# EAGLE design beagletone_studio (EAGLE 6.4)

## Sheet 1 of 3
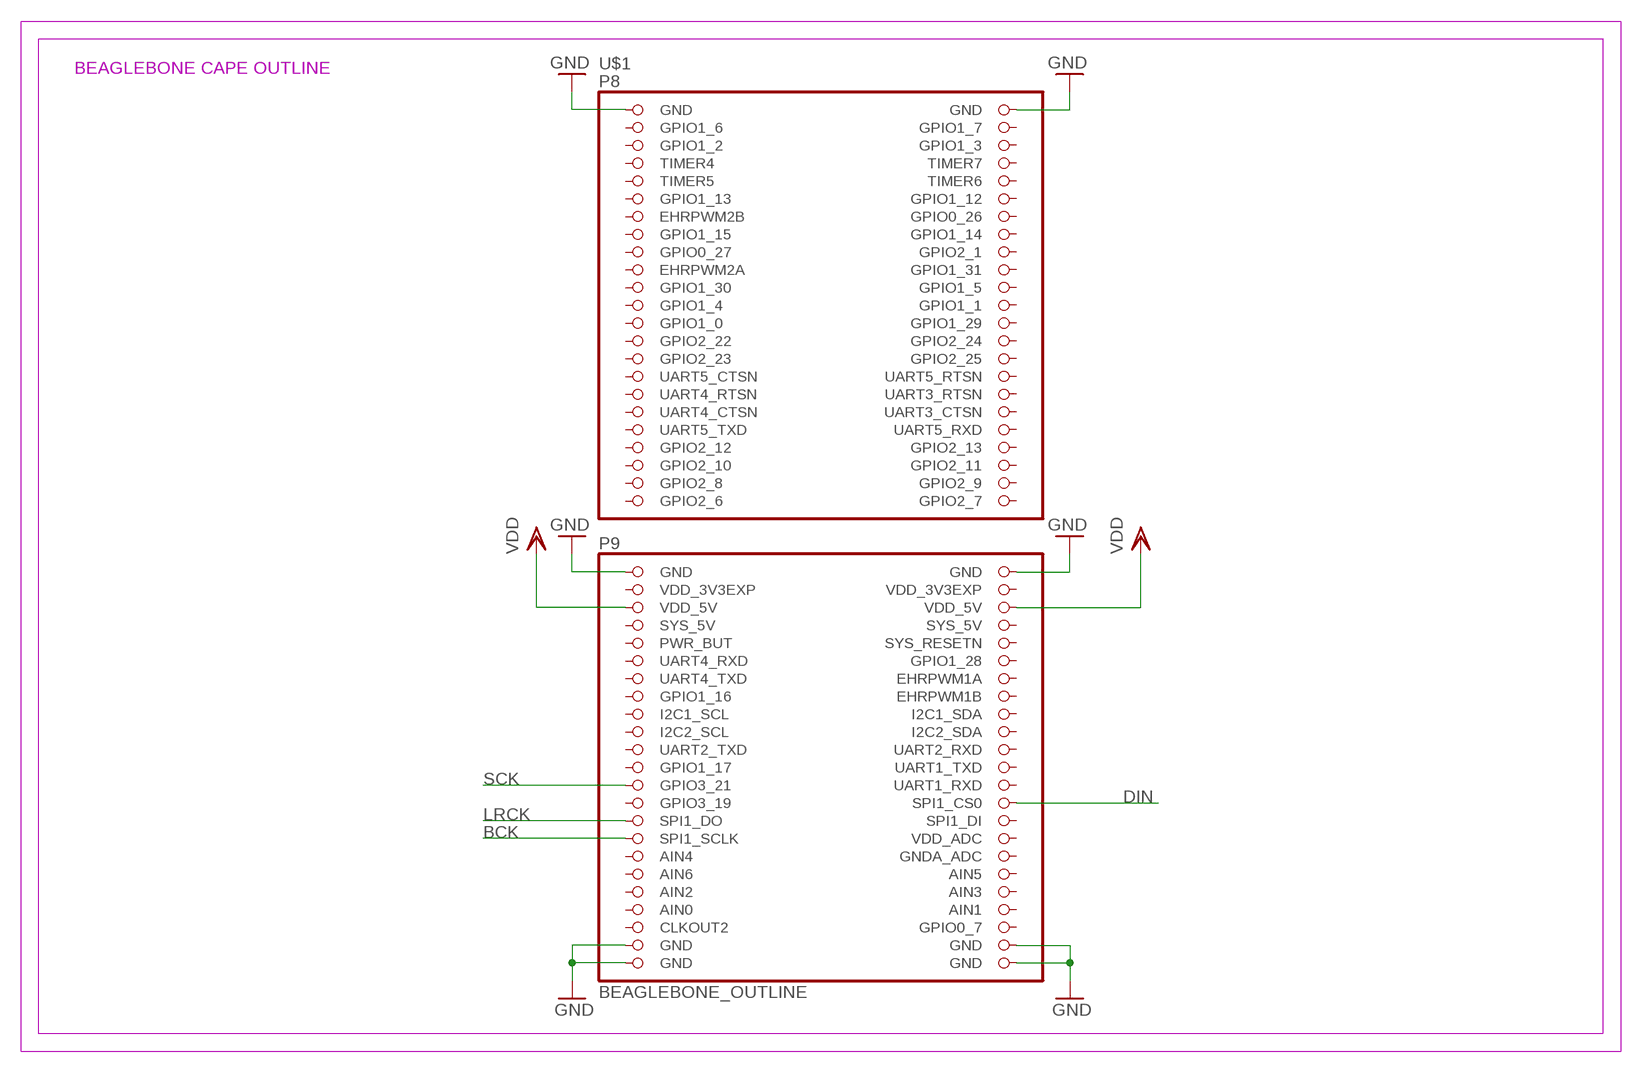
[diagram p0: schematic, sheet 1]

### Parts
U$1  BEAGLEBONE_OUTLINE  [BEAGLEBONE_SHIELD]

### Nets
BCK: U$1.77(SPI1_SCLK) ; also sheet 2
DIN: U$1.74(SPI1_CS0) ; also sheet 2
GND: U$1.1(GND) U$1.2(GND) U$1.47(GND) U$1.48(GND) U$1.89(GND) U$1.90(GND) U$1.91(GND) U$1.92(GND) ; also sheet 2,3
LRCK: U$1.75(SPI1_DO) ; also sheet 2
SCK: U$1.71(GPIO3_21) ; also sheet 2
VDD: U$1.51(VDD_5V) U$1.52(VDD_5V) ; also sheet 2
Unconnected: U$1.3(GPIO1_6) U$1.4(GPIO1_7) U$1.5(GPIO1_2) U$1.6(GPIO1_3) U$1.7(TIMER4) U$1.8(TIMER7) U$1.9(TIMER5) U$1.10(TIMER6) U$1.11(GPIO1_13) U$1.12(GPIO1_12) U$1.13(EHRPWM2B) U$1.14(GPIO0_26) U$1.15(GPIO1_15) U$1.16(GPIO1_14) U$1.17(GPIO0_27) U$1.18(GPIO2_1) U$1.19(EHRPWM2A) U$1.20(GPIO1_31) U$1.21(GPIO1_30) U$1.22(GPIO1_5) U$1.23(GPIO1_4) U$1.24(GPIO1_1) U$1.25(GPIO1_0) U$1.26(GPIO1_29) U$1.27(GPIO2_22) U$1.28(GPIO2_24) U$1.29(GPIO2_23) U$1.30(GPIO2_25) U$1.31(UART5_CTSN) U$1.32(UART5_RTSN) U$1.33(UART4_RTSN) U$1.34(UART3_RTSN) U$1.35(UART4_CTSN) U$1.36(UART3_CTSN) U$1.37(UART5_TXD) U$1.38(UART5_RXD) U$1.39(GPIO2_12) U$1.40(GPIO2_13) U$1.41(GPIO2_10) U$1.42(GPIO2_11) U$1.43(GPIO2_8) U$1.44(GPIO2_9) U$1.45(GPIO2_6) U$1.46(GPIO2_7) U$1.54(SYS_5V) U$1.55(PWR_BUT) U$1.56(SYS_RESETN) U$1.57(UART4_RXD) U$1.58(GPIO1_28) U$1.59(UART4_TXD) U$1.60(EHRPWM1A) U$1.61(GPIO1_16) U$1.62(EHRPWM1B) U$1.63(I2C1_SCL) U$1.64(I2C1_SDA) U$1.65(I2C2_SCL) U$1.66(I2C2_SDA) U$1.67(UART2_TXD) U$1.68(UART2_RXD) U$1.69(GPIO1_17) U$1.70(UART1_TXD) U$1.72(UART1_RXD) U$1.73(GPIO3_19) U$1.76(SPI1_DI) U$1.78(VDD_ADC) U$1.79(AIN4) U$1.80(GNDA_ADC) U$1.81(AIN6) U$1.82(AIN5) U$1.83(AIN2) U$1.84(AIN3) U$1.86(AIN1) U$1.87(CLKOUT2) U$1.88(GPIO0_7)

### Notes on the sheet
- BEAGLEBONE CAPE OUTLINE

## Sheet 2 of 3
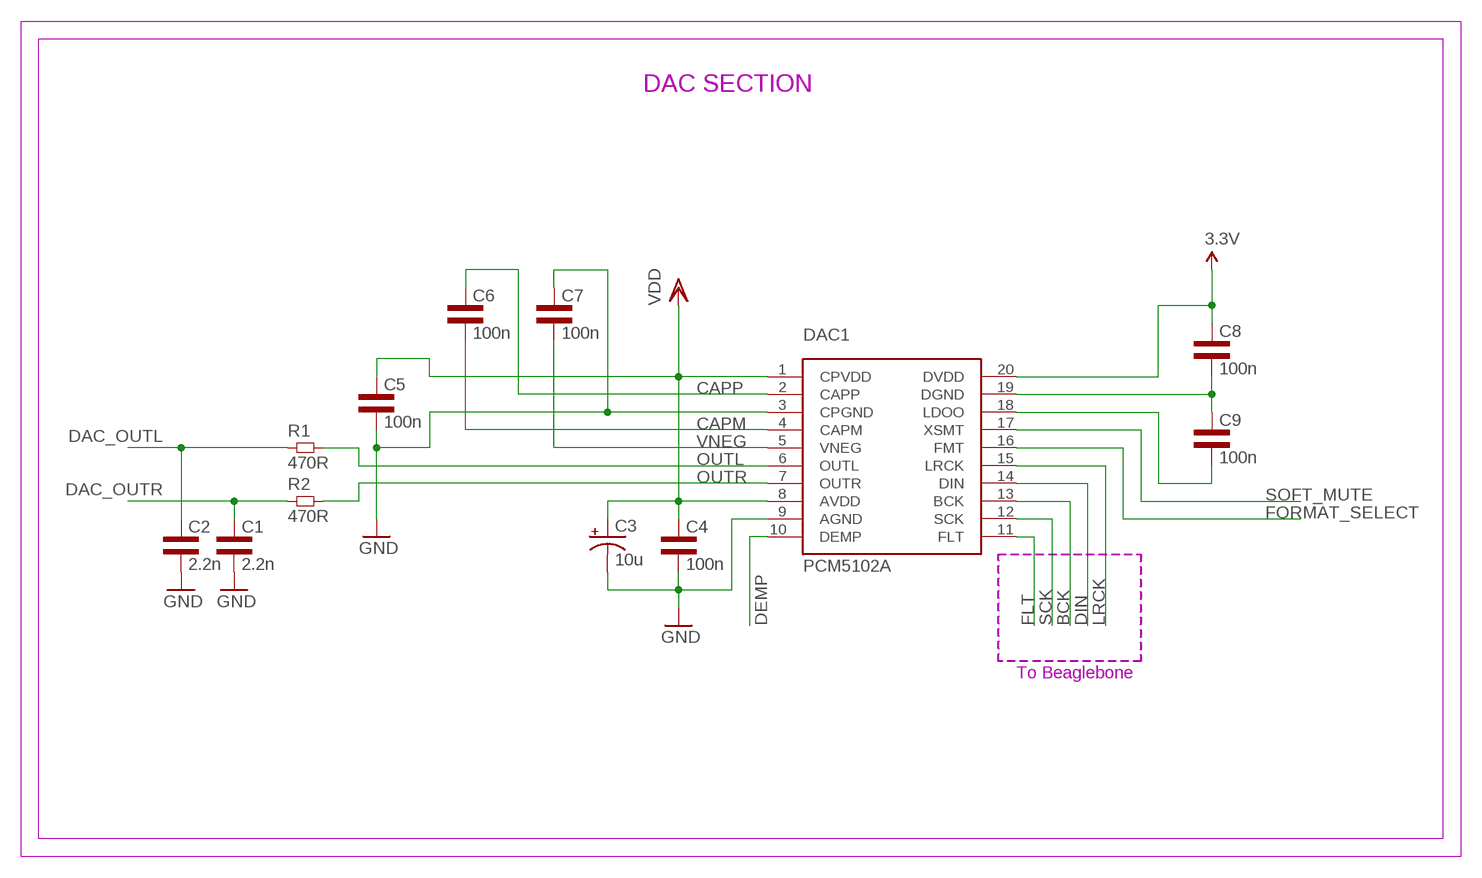
[diagram p1: schematic, sheet 2]

### Parts
C1  2.2n  CAP0603L3  [0603L3]
C2  2.2n  CAP0603L3  [0603L3]
C3  10u  CPOL-USCT3216  [CT3216]
C4  100n  CAP0603L3  [0603L3]
C5  100n  CAP0603L3  [0603L3]
C6  100n  CAP0603L3  [0603L3]
C7  100n  CAP0603L3  [0603L3]
C8  100n  CAP0402L3  [0402L3]
C9  100n  CAP0402L3  [0402L3]
DAC1  PCM5102A  [R-PDSO-G20_65]
R1  470R  RES0603L3  [0603L3]
R2  470R  RES0603L3  [0603L3]

### Nets
3.3V: C8.P$1 DAC1.20(DVDD)
BCK: DAC1.13(BCK) ; also sheet 1
CAPM: C6.P$2 DAC1.4(CAPM)
CAPP: C6.P$1 DAC1.2(CAPP)
DAC_OUTL: C2.P$1 R1.P$1 ; also sheet 3
DAC_OUTR: C1.P$1 R2.P$1 ; also sheet 3
DEMP: DAC1.10(DEMP)
DIN: DAC1.14(DIN) ; also sheet 1
FLT: DAC1.11(FLT)
FORMAT_SELECT: DAC1.16(FMT)
GND: C1.P$2 C2.P$2 C3.- C4.P$2 C5.P$2 C7.P$1 DAC1.3(CPGND) DAC1.9(AGND) ; also sheet 1,3
LRCK: DAC1.15(LRCK) ; also sheet 1
N$1: C8.P$2 C9.P$1 DAC1.19(DGND)
N$3: C9.P$2 DAC1.18(LDOO)
OUTL: DAC1.6(OUTL) R1.P$2
OUTR: DAC1.7(OUTR) R2.P$2
SCK: DAC1.12(SCK) ; also sheet 1
SOFT_MUTE: DAC1.17(XSMT)
VDD: C3.+ C4.P$1 C5.P$1 DAC1.1(CPVDD) DAC1.8(AVDD) ; also sheet 1
VNEG: C7.P$2 DAC1.5(VNEG)

### Notes on the sheet
- DAC SECTION
- To Beaglebone

## Sheet 3 of 3
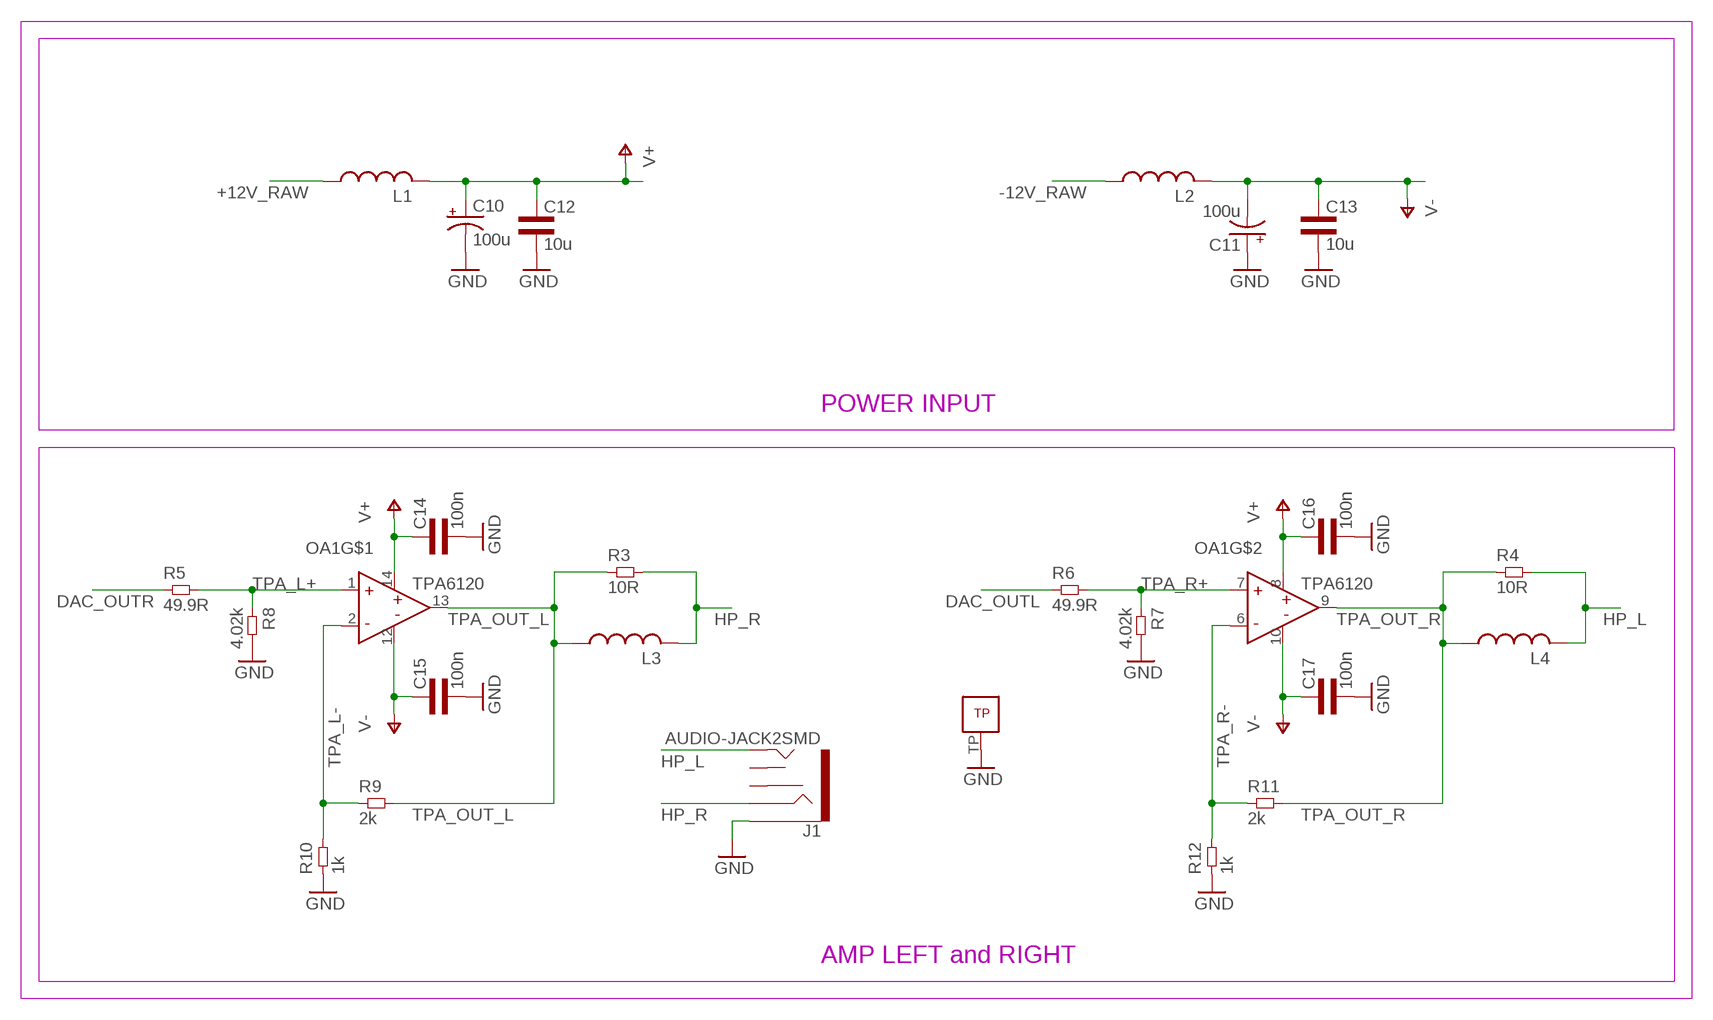
[diagram p2: schematic, sheet 3]

### Parts
C10  100u  CPOL-USCT7343  [CT7343]
C11  100u  CPOL-USCT7343  [CT7343]
C12  10u  CAP0805L3  [0805L3]
C13  10u  CAP0805L3  [0805L3]
C14  100n  CAP0603L3  [0603L3]
C15  100n  CAP0603L3  [0603L3]
C16  100n  CAP0603L3  [0603L3]
C17  100n  CAP0603L3  [0603L3]
J1  AUDIO-JACK2SMD  [AUDIO-JACK-3.5MM-SMD]
L1  L-USL2012C  [L2012C]
L2  L-USL2012C  [L2012C]
L3  L-USL2012C  [L2012C]
L4  L-USL2012C  [L2012C]
OA1  TPA6120QFN  [S-PVQFN-N14]
R3  10R  RES0805L3  [0805L3]
R4  10R  RES0805L3  [0805L3]
R5  49.9R  RES0603L3  [0603L3]
R6  49.9R  RES0603L3  [0603L3]
R7  4.02k  RES0603L3  [0603L3]
R8  4.02k  RES0603L3  [0603L3]
R9  2k  RES0603L3  [0603L3]
R10  1k  RES0603L3  [0603L3]
R11  2k  RES0603L3  [0603L3]
R12  1k  RES0603L3  [0603L3]

### Nets
+12V_RAW: L1.1
-12V_RAW: L2.1
DAC_OUTL: R6.P$1 ; also sheet 2
DAC_OUTR: R5.P$1 ; also sheet 2
GND: C10.- C11.+ C12.2 C13.2 C14.P$2 C15.P$2 C16.P$2 C17.P$2 J1.SLEEVE OA1.TP R7.P$2 R8.P$2 R10.P$1 R12.P$1 ; also sheet 1,2
HP_L: J1.TIP L4.2 R4.2
HP_R: J1.RING L3.2 R3.2
TPA_L+: OA1.1(IN+) R5.P$2 R8.P$1
TPA_L-: OA1.2(IN-) R9.P$1 R10.P$2
TPA_OUT_L: L3.1 OA1.13(OUT) R3.1 R9.P$2
TPA_OUT_R: L4.1 OA1.9(OUT) R4.1 R11.P$2
TPA_R+: OA1.7(IN+) R6.P$2 R7.P$1
TPA_R-: OA1.6(IN-) R11.P$1 R12.P$2
V+: C10.+ C12.1 C14.P$1 C16.P$1 L1.2 OA1.8(V+) OA1.14(V+)
V-: C11.- C13.1 C15.P$1 C17.P$1 L2.2 OA1.10(V-) OA1.12(V-)
Unconnected: J1.RSH J1.TSH

### Notes on the sheet
- POWER INPUT
- AMP LEFT and RIGHT

## Power pins joined to a net without a drawn wire
AIN0: U$1.85(AIN0)
SYS_5V: U$1.53(SYS_5V)
VDD_3V3EXP: U$1.49(VDD_3V3EXP) U$1.50(VDD_3V3EXP)

## Library data of the parts
C1 C2 C4-C9 C12-C17 = common:CAP
C3 C10 C11 = rcl:CPOL-US: POLARIZED CAPACITOR, American symbol
DAC1 = common:PCM5102A: PCM5102A - 32-Bit, 384KHz stereo DAC with I2S PCM interface.
J1 = SparkFun-Connectors:AUDIO-JACK2: Stereo audio jack with bypass switches. Used on LilyPad MP3 board. Production SKU: CONN-10353; PROD_ID: CONN-10353
L1-L4 = rcl:L-US: INDUCTOR, American symbol
OA1 = common:TPA6120
R1-R12 = common:RES
U$1 = adafruit:BEAGLEBONE_OUTLINE: Should match A3 pinout - but not completely tested

## Board
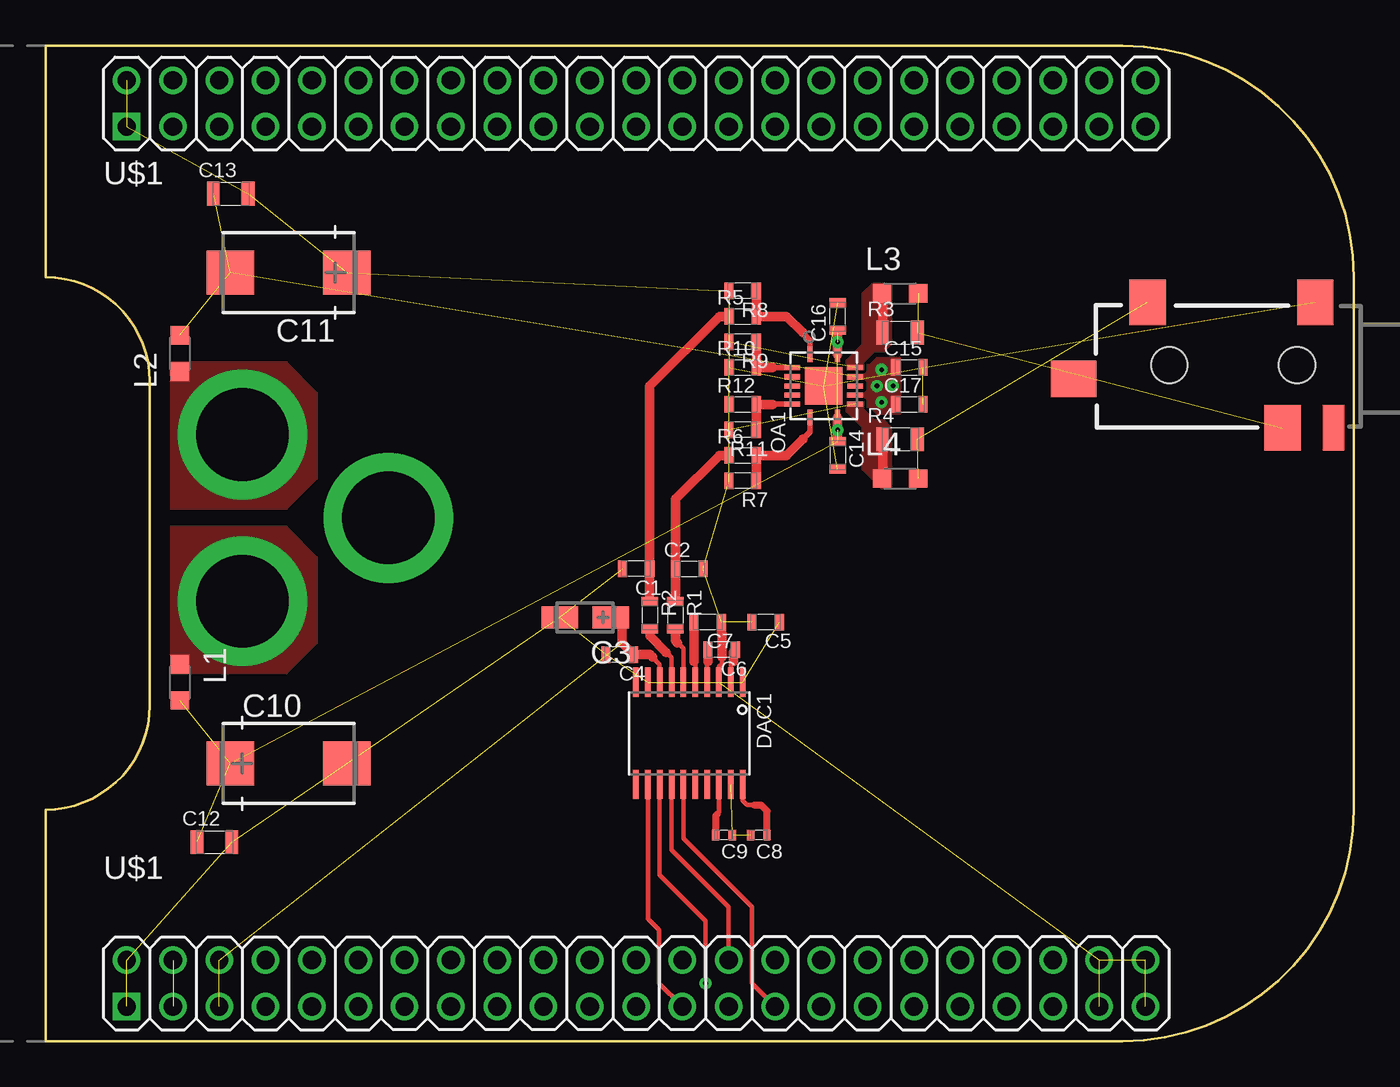
[diagram p3: board, top side]
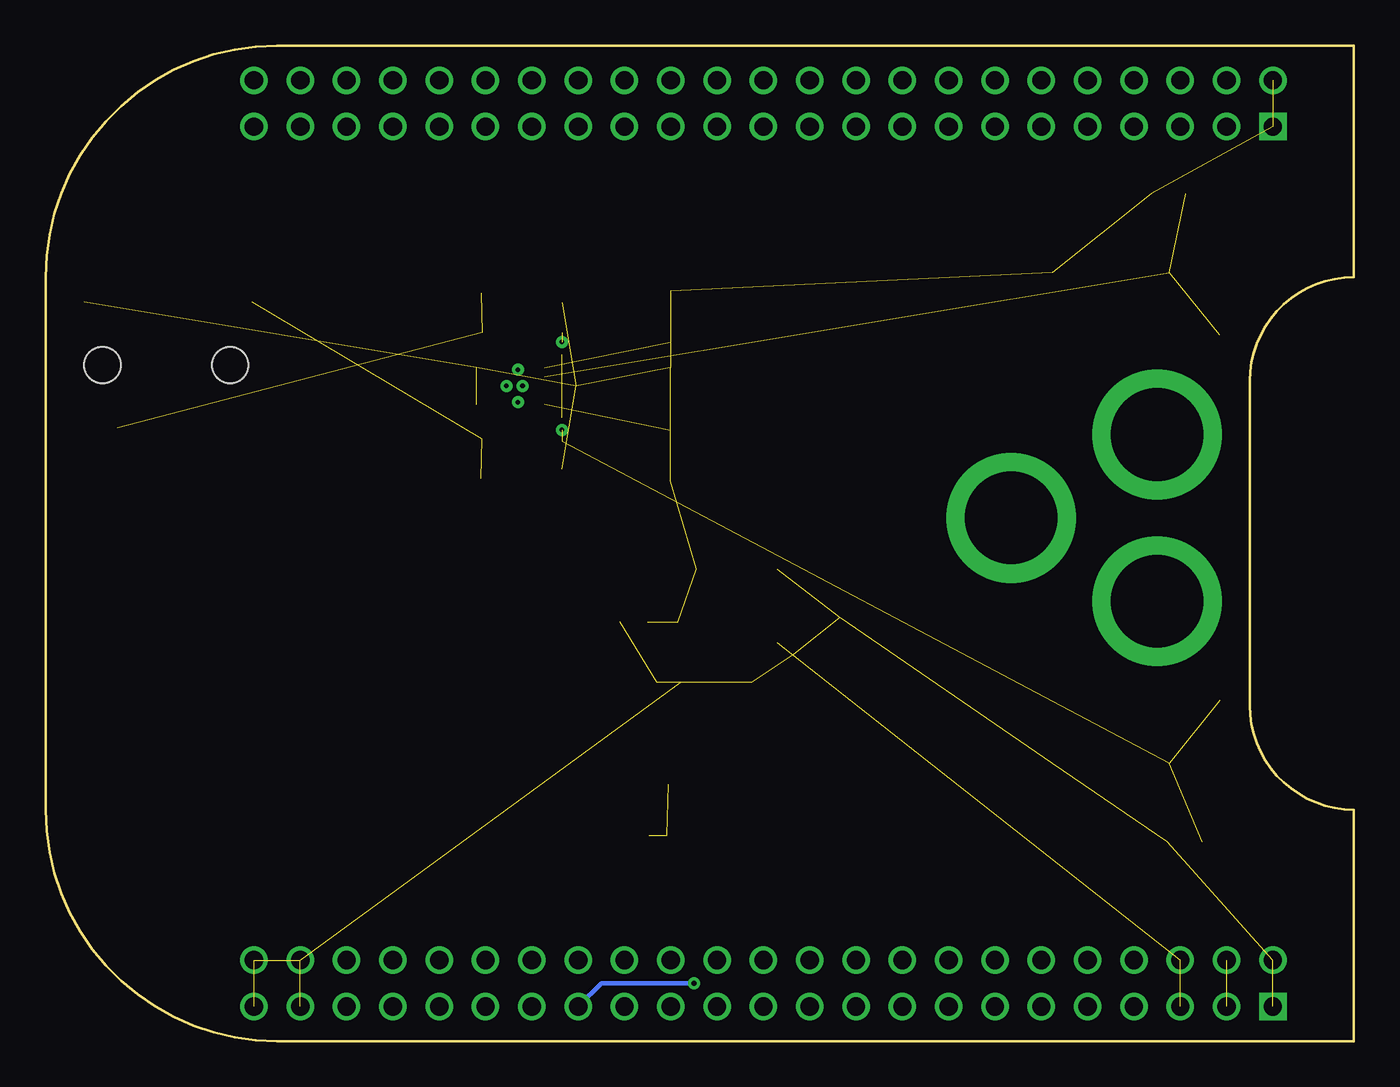
[diagram p4: board, bottom side, seen from below]

Size 71.75 x 54.61 mm. Coordinates in mm from the lower left corner, seen from the top.
Copper layers (1*16): Top 0.035mm / dielectric 1.5mm / Bottom 0.035mm
Design rules "default": minimum track width 10mil, minimum drill 24mil, track to track 8mil, track to pad 8mil, pad to pad 8mil, via to via 8mil, smd to smd 8mil, copper to edge 40mil, drill to drill 8mil, minimum pad ring 10mil, minimum via ring 8mil, stop-mask expansion 4mil, vias tented up to drill 0mil, thermal gap 10mil

### Footprints (pad centres in the part's own frame; a part is rotated, then mirrored left to right if it is on the bottom)
0603L3 = smd 0.5 x 0.9: P$1 -0.75,0; P$2 0.75,0
CT3216 = smd 2 x 1.2: + -1.4,0; - 1.4,0
0402L3 = smd 0.4 x 0.6: P$1 -0.45,0; P$2 0.45,0
CT7343 = smd 2.6 x 2.4: + -3.2,0; - 3.2,0
0805L3 = smd 0.7 x 1.3: 1 -0.95,0; 2 0.95,0
R-PDSO-G20_65 = smd 0.3 x 1.6: 1 -2.925,-2.8; 2 -2.275,-2.8; 3 -1.625,-2.8; 4 -0.975,-2.8; 5 -0.325,-2.8; 6 0.325,-2.8; 7 0.975,-2.8; 8 1.625,-2.8; 9 2.275,-2.8; 10 2.925,-2.8; 11 2.925,2.8; 12 2.275,2.8; 13 1.625,2.8; 14 0.975,2.8; 15 0.325,2.8; 16 -0.325,2.8; 17 -0.975,2.8; 18 -1.625,2.8; 19 -2.275,2.8; 20 -2.925,2.8
AUDIO-JACK-3.5MM-SMD = smd 2 x 2.5: RING 4.3,3.45; SLEEVE 2.5,-3.45; TIP 11.7,-3.45 | smd 1.2 x 2.5: RSH 1.5,3.45 | smd 2.5 x 2: TSH 15.75,0.75 | hole 2: 3.5,0; 10.5,0
L2012C = smd 1 x 1: 1 -1,0; 2 1,0
S-PVQFN-N14 = smd 0.85 x 0.28: 1 -1.725,-0.75; 7 1.725,-0.75; 8 1.725,0.75; 14 -1.725,0.75 | smd 0.28 x 0.85: 2 -1,-1.725; 3 -0.5,-1.725; 4 0,-1.725; 5 0.5,-1.725; 6 1,-1.725; 9 1,1.725; 10 0.5,1.725; 11 0,1.725; 12 -0.5,1.725; 13 -1,1.725 | smd 2.05 x 2.05: TP 0,0
BEAGLEBONE_SHIELD = drill 1 square: 1 4.445,19.05; 47 52.705,19.05 | drill 1: 2 1.905,19.05; 3 4.445,21.59; 4 1.905,21.59; 5 4.445,24.13; 6 1.905,24.13; 7 4.445,26.67; 8 1.905,26.67; 9 4.445,29.21; 10 1.905,29.21; 11 4.445,31.75; 12 1.905,31.75; 13 4.445,34.29; 14 1.905,34.29; 15 4.445,36.83; 16 1.905,36.83; 17 4.445,39.37; 18 1.905,39.37; 19 4.445,41.91; 20 1.905,41.91; 21 4.445,44.45; 22 1.905,44.45; 23 4.445,46.99; 24 1.905,46.99; 25 4.445,49.53; 26 1.905,49.53; 27 4.445,52.07; 28 1.905,52.07; 29 4.445,54.61; 30 1.905,54.61; 31 4.445,57.15; 32 1.905,57.15; 33 4.445,59.69; 34 1.905,59.69; 35 4.445,62.23; 36 1.905,62.23; 37 4.445,64.77; 38 1.905,64.77; 39 4.445,67.31; 40 1.905,67.31; 41 4.445,69.85; 42 1.905,69.85; 43 4.445,72.39; 44 1.905,72.39; 45 4.445,74.93; 46 1.905,74.93; 48 50.165,19.05; 49 52.705,21.59; 50 50.165,21.59; 51 52.705,24.13; 52 50.165,24.13; 53 52.705,26.67; 54 50.165,26.67; 55 52.705,29.21; 56 50.165,29.21; 57 52.705,31.75; 58 50.165,31.75; 59 52.705,34.29; 60 50.165,34.29; 61 52.705,36.83; 62 50.165,36.83; 63 52.705,39.37; 64 50.165,39.37; 65 52.705,41.91; 66 50.165,41.91; 67 52.705,44.45; 68 50.165,44.45; 69 52.705,46.99; 70 50.165,46.99; 71 52.705,49.53; 72 50.165,49.53; 73 52.705,52.07; 74 50.165,52.07; 75 52.705,54.61; 76 50.165,54.61; 77 52.705,57.15; 78 50.165,57.15; 79 52.705,59.69; 80 50.165,59.69; 81 52.705,62.23; 82 50.165,62.23; 83 52.705,64.77; 84 50.165,64.77; 85 52.705,67.31; 86 50.165,67.31; 87 52.705,69.85; 88 50.165,69.85; 89 52.705,72.39; 90 50.165,72.39; 91 52.705,74.93; 92 50.165,74.93

### Placement (x,y rotation side)
C1  32.39,25.91 180 top
C2  35.31,25.91 0 top
C3  29.59,23.24 180 top
C4  31.5,21.21 180 top
C5  39.5,22.99 180 top
C6  37.08,21.46 180 top
C7  36.32,22.99 180 top
C8  39.12,11.3 180 top
C9  37.21,11.3 180 top
C10  13.34,15.24 0 top
C11  13.34,42.16 180 top
C12  9.27,10.92 0 top
C13  10.16,46.48 0 top
C14  43.43,32.13 270 top
C15  47.37,36.96 0 top
C16  43.43,39.75 90 top
C17  47.37,34.92 0 top
DAC1  35.31,16.89 180 top
J1  72.14,37.08 180 top
L1  7.37,19.69 270 top
L2  7.37,37.72 90 top
L3  46.86,41.02 0 top
L4  46.86,30.86 0 top
OA1  42.67,35.94 270 top
R1  34.54,23.37 270 top
R2  33.15,23.37 270 top
R3  46.86,38.86 0 top
R4  46.86,33.02 0 top
R5  38.23,39.75 0 top
R6  38.23,32.13 0 top
R7  38.23,30.73 180 top
R8  38.23,41.15 180 top
R9  38.23,38.35 180 top
R10  38.23,36.96 0 top
R11  38.23,33.53 180 top
R12  38.23,34.92 0 top
U$1  -14.6,54.61 270 top

### Tracks (layer width: path | path; a pad name or v marks a point on that pad's centre or on a via)
3.3V
  Top 0.254: DAC1.20 38.23,13.2 38.48,12.95 38.86,12.95
  Top 0.381: 38.86,12.95 39.24,12.95 39.57,12.63 C8.P$1
+12V_RAW  (via drill 5.08 pad 7.11)
  other vias: 10.8,24.13
  pour Top (no thermals): 13.21,28.19 6.48,28.19 6.48,20.19 13.21,20.19 14.86,21.84 14.86,26.54
-12V_RAW  (via drill 5.08 pad 7.11)
  other vias: 10.8,33.27
  pour Top (no thermals): 13.21,37.21 6.48,37.21 6.48,29.21 13.21,29.21 14.86,30.86 14.86,35.56
BCK  (via drill 0.25)
  Top 0.254: DAC1.13 33.68,9.12 36.2,6.6 v36.2,3.17
  Bottom 0.254: v36.2,3.17 41.28,3.17 U$1.77
CAPM
  Top 0.254: DAC1.4 36.28,20.79 36.32,20.83
  Top 0.508: 36.32,20.83 36.32,21.45 C6.P$2
CAPP
  Top 0.254: DAC1.2 37.58,20.69 37.72,20.83
  Top 0.508: 37.72,20.83 37.72,21.35 C6.P$1
DAC_OUTL
  Top 0.508: R1.P$1 34.56,24.13 C2.P$1 34.56,29.73 36.96,32.13 R6.P$1
DAC_OUTR
  Top 0.508: R2.P$1 C1.P$1 33.14,35.93 36.96,39.75 R5.P$1
DIN
  Top 0.254: DAC1.14 34.33,10.5 37.47,7.37 U$1.74
GND  (28 unrouted)
  Top 0.254: DAC1.3 36.93,20.55 37.08,20.7 37.08,21.08
  Top 0.508: 37.08,21.08 37.08,22.36 37.07,22.38 C7.P$1
HP_L  (2 unrouted)
HP_R  (2 unrouted)
LRCK
  Top 0.254: DAC1.15 34.98,11.12 38.74,7.37 38.74,3.17 U$1.75
N$1  (2 unrouted)
N$3
  Top 0.254: DAC1.18 36.93,12.55 36.83,12.45
  Top 0.381: C9.P$2 36.76,12.38 36.83,12.45
N$5  (via drill 5.08 pad 7.11)
  other vias: 18.8,28.7
OUTL
  Top 0.254: DAC1.6 34.98,21.53 34.67,21.84
  Top 0.508: 34.67,21.84 34.54,21.97 R1.P$2
OUTR
  Top 0.254: DAC1.7 34.33,21.04 34.04,21.34
  Top 0.508: 34.04,21.34 33.15,22.23 R2.P$2
SCK
  Top 0.254: DAC1.12 33.03,6.72 33.66,6.1 33.66,3.17 U$1.71
TPA_L+
  Top 0.292: OA1.1 41.92,38.47 41.53,38.86
  Top 0.508: R8.P$1 R5.P$2 40.64,39.75 41.53,38.86
TPA_L-
  Top 0.292: OA1.2 39.89,36.94 39.88,36.96
  Top 0.508: R9.P$1 R10.P$2 39.88,36.96
TPA_OUT_L  (1 unrouted)
  Top 0.508: R3.1 45.91,40.97 L3.1
  pour Top (no thermals): 43.94,36.83 43.94,37.34 44.83,38.23 44.83,41.02 45.34,41.53 46.36,41.53 46.36,38.23 45.97,37.85 45.47,37.85 44.83,37.21 44.83,36.83
TPA_OUT_R  (1 unrouted)
  Top 0.508: R4.1 45.91,30.91 L4.1
  pour Top (no thermals): 43.94,35.05 43.94,34.54 44.83,33.66 44.83,31.37 45.85,30.35 46.36,30.35 46.36,33.66 45.97,34.04 45.47,34.04 44.83,34.67 44.83,35.05
TPA_R+
  Top 0.292: OA1.7 41.92,33.41 41.53,33.02
  Top 0.508: R7.P$1 R6.P$2 40.64,32.13 41.53,33.02
TPA_R-
  Top 0.292: OA1.6 39.89,34.94 39.88,34.92
  Top 0.508: R11.P$1 R12.P$2 39.88,34.92
V+  (via drill 0.25)  (6 unrouted)
  Top 0.508: OA1.8 43.42,32.89 C14.P$1 | OA1.14 43.42,38.86 C16.P$1
  other vias: 43.43,38.35 43.43,33.53
V-  (via drill 0.25)  (3 unrouted)
  other vias: 45.85,36.83 45.59,35.94 45.85,35.05 46.48,35.94
  pour Top (no thermals): 43.94,37.08 45.21,37.08 45.59,37.46 46.86,37.46 46.86,34.42 45.59,34.42 45.21,34.8 43.94,34.8
VDD  (4 unrouted)
  Top 0.254: DAC1.8 33.68,20.67 33.27,21.08
  Top 0.508: 33.27,21.08 33.15,21.21 C4.P$1 31.62,21.83 31.62,22.73 31.12,23.24 C3.+
VDD_3V3EXP  (1 unrouted)
VNEG
  Top 0.254: DAC1.5 35.63,20.76 35.56,20.83
  Top 0.508: 35.56,20.83 35.56,22.34 35.57,22.35 C7.P$2